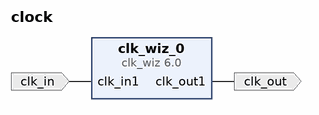
[diagram p0: block diagram of the top level]
# Vivado block design clock, xc7a35ticsg324-1L, Vivado 2023.2
create_bd_design clock

create_bd_port -dir I -type clk clk_in
set_property -dict {CONFIG.FREQ_HZ 100000000} [get_bd_ports clk_in]
create_bd_port -dir O -type clk clk_out

create_bd_cell -type ip -vlnv xilinx.com:ip:clk_wiz:6.0 clk_wiz_0
set_property -dict {CONFIG.USE_RESET false} [get_bd_cells clk_wiz_0]

# ---- connections ----

connect_bd_net [get_bd_ports clk_in] [get_bd_pins clk_wiz_0/clk_in1]
connect_bd_net [get_bd_pins clk_wiz_0/clk_out1] [get_bd_ports clk_out]

validate_bd_design
save_bd_design
